# Altium schematic sheet MEMORY.SchDoc
size A4
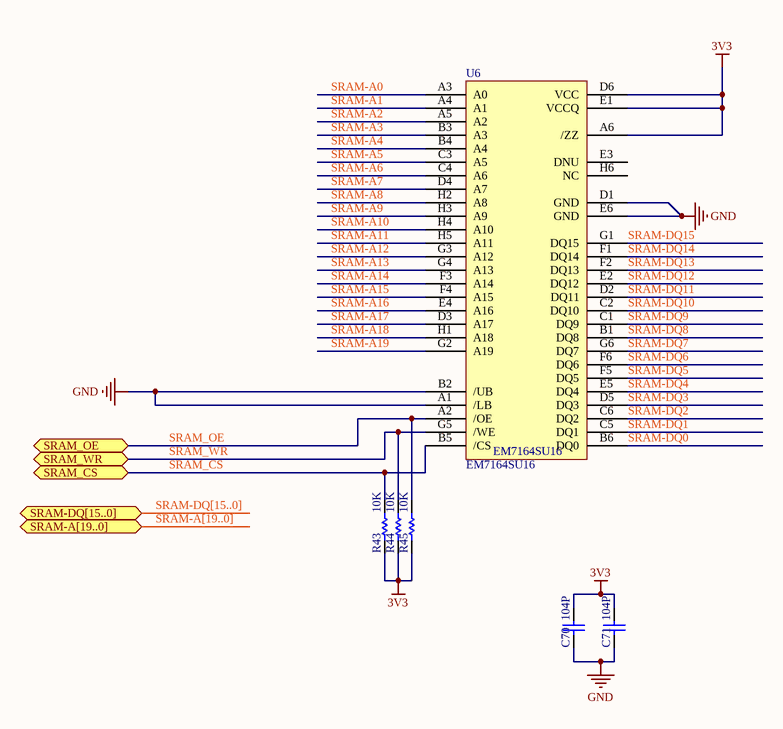
[diagram p0: MEMORY.SchDoc]

## Parts
C70  value 104P  [1608[0603]]  (hidden comment: Cap)
C71  value 104P  [1608[0603]]  (hidden comment: Cap)
R43  value 10K  [1608[0603]]  (hidden comment: Res)
R44  value 10K  [1608[0603]]  (hidden comment: Res)
R45  value 10K  [1608[0603]]  (hidden comment: Res)
U6  EM7164SU16  [BGA48C75P6X8_598X698X104]

## Ports
SRAM-A[19..0], SRAM-DQ[15..0], SRAM_CS, SRAM_OE, SRAM_WR

## Nets
3V3: C70.2 C71.2 R43.2 R44.2 R45.2 U6.A6(/ZZ) U6.D6(VCC) U6.E1(VCCQ)
GND: C70.1 C71.1 U6.A1(/LB) U6.B2(/UB) U6.D1(GND) U6.E6(GND)
SRAM-A0: U6.A3(A0)
SRAM-A1: U6.A4(A1)
SRAM-A2: U6.A5(A2)
SRAM-A3: U6.B3(A3)
SRAM-A4: U6.B4(A4)
SRAM-A5: U6.C3(A5)
SRAM-A6: U6.C4(A6)
SRAM-A7: U6.D4(A7)
SRAM-A8: U6.H2(A8)
SRAM-A9: U6.H3(A9)
SRAM-A10: U6.H4(A10)
SRAM-A11: U6.H5(A11)
SRAM-A12: U6.G3(A12)
SRAM-A13: U6.G4(A13)
SRAM-A14: U6.F3(A14)
SRAM-A15: U6.F4(A15)
SRAM-A16: U6.E4(A16)
SRAM-A17: U6.D3(A17)
SRAM-A18: U6.H1(A18)
SRAM-A19: U6.G2(A19)
SRAM-DQ0: U6.B6(DQ0)
SRAM-DQ1: U6.C5(DQ1)
SRAM-DQ2: U6.C6(DQ2)
SRAM-DQ3: U6.D5(DQ3)
SRAM-DQ4: U6.E5(DQ4)
SRAM-DQ5: U6.F5(DQ5)
SRAM-DQ6: U6.F6(DQ6)
SRAM-DQ7: U6.G6(DQ7)
SRAM-DQ8: U6.B1(DQ8)
SRAM-DQ9: U6.C1(DQ9)
SRAM-DQ10: U6.C2(DQ10)
SRAM-DQ11: U6.D2(DQ11)
SRAM-DQ12: U6.E2(DQ12)
SRAM-DQ13: U6.F2(DQ13)
SRAM-DQ14: U6.F1(DQ14)
SRAM-DQ15: U6.G1(DQ15)
SRAM_CS: R43.1 U6.B5(/CS) ; port SRAM_CS
SRAM_OE: R45.1 U6.A2(/OE) ; port SRAM_OE
SRAM_WR: R44.1 U6.G5(/WE) ; port SRAM_WR

Not connected (* = marked no-connect by the designer): U6 E3(DNU) H6(NC)

## Buses and harness runs
bus SRAM-A[19..0] = port SRAM-A[19..0]
bus SRAM-DQ[15..0] = port SRAM-DQ[15..0]

## Library data of the parts
C70 C71 = Cap: 贴片电容; Published: 8-Jun-2000; LatestRevisionDate: 17-Jul-2002; LatestRevisionNote: Re-released for DXP Platform.; PackageReference: RAD-0.3; Publisher: Altium Limited
R43-R45 = Res: 贴片电阻; Published: 8-Jun-2000; LatestRevisionDate: 17-Jul-2002; LatestRevisionNote: Re-released for DXP Platform.; PackageReference: AXIAL-0.3; Publisher: Altium Limited